# EAGLE design RM1xx-Breakout-min (EAGLE 7.7.0)
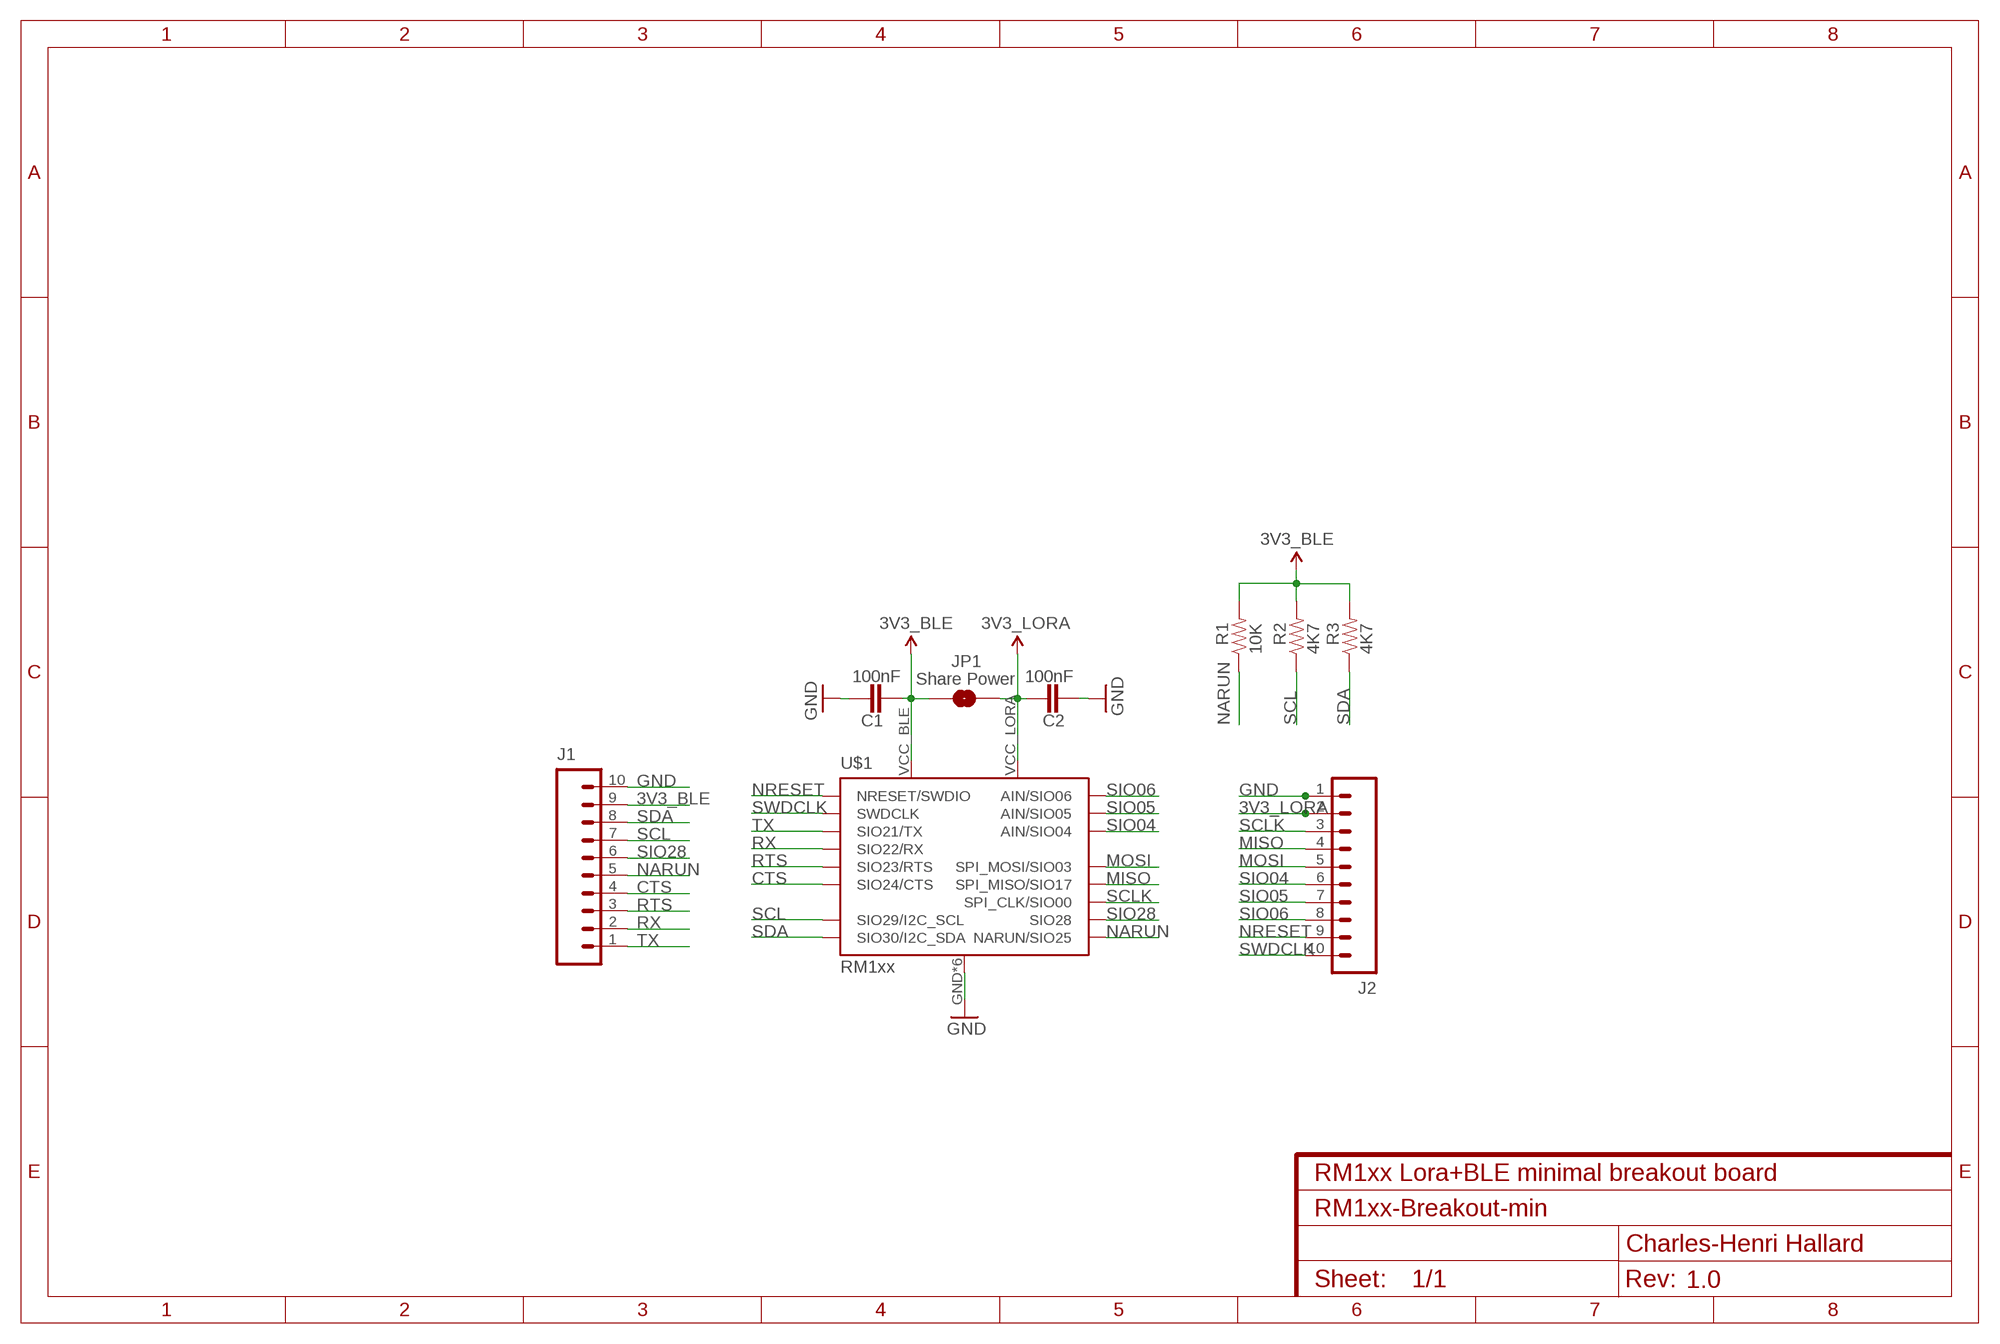
[diagram p0: schematic, sheet 1]
NAME (FRAME-A4L): CNAME: RM1xx Lora+BLE minimal breakout board; CREVISION: 1.0; DESIGNER: Charles-Henri Hallard

## Parts
C1  100nF  CAP0805-CAP  [0805-CAP]
C2  100nF  CAP0805-CAP  [0805-CAP]
J1  M10LOCK  [1X10_LOCK]
J2  M10LOCK  [1X10_LOCK]
JP1  Share Power  JUMPER-PAD-2-NOYES_SILK  [PAD-JUMPER-2-NO_YES_SILK]
R1  10K  RESISTOR0805-RES  [0805-RES]
R2  4K7  RESISTOR0805-RES  [0805-RES]
R3  4K7  RESISTOR0805-RES  [0805-RES]
U$1  RM1xx  RM1XXSMD  [RM1XX]

## Nets
3V3_BLE: C1.2 J1.9 JP1.1 R1.2 R2.2 R3.2 U$1.VCC_BLE
3V3_LORA: C2.1 J2.2 JP1.2 U$1.VCC_LORA
CTS: J1.4 U$1.SIO24(SIO24/CTS)
GND: C1.1 C2.2 J1.10 J2.1 U$1.GND U$1.GND1(GND) U$1.GND2(GND) U$1.GND3(GND) U$1.GND4(GND) U$1.GND5(GND)
MISO: J2.4 U$1.SIO17(SPI_MISO/SIO17)
MOSI: J2.5 U$1.SIO03(SPI_MOSI/SIO03)
NARUN: J1.5 R1.1 U$1.SIO25(NARUN/SIO25)
NRESET: J2.9 U$1.RESET(NRESET/SWDIO)
RTS: J1.3 U$1.SIO23(SIO23/RTS)
RX: J1.2 U$1.SIO22(SIO22/RX)
SCL: J1.7 R2.1 U$1.SIO29(SIO29/I2C_SCL)
SCLK: J2.3 U$1.SIO00(SPI_CLK/SIO00)
SDA: J1.8 R3.1 U$1.SIO30(SIO30/I2C_SDA)
SIO04: J2.6 U$1.SIO04(AIN/SIO04)
SIO05: J2.7 U$1.SIO05(AIN/SIO05)
SIO06: J2.8 U$1.SIO06(AIN/SIO06)
SIO28: J1.6 U$1.SIO28
SWDCLK: J2.10 U$1.SWDCLK
TX: J1.1 U$1.SIO21(SIO21/TX)

## Library data of the parts
C1 C2 = LowPowerLab:CAP: Capacitor Standard 0603 ceramic capacitor, and 0.1" leaded capacitor.
J1 J2 = SparkFun-Connectors:M10: Header 10 Standard 10-pin 0.1" header. Use with straight break away headers (SKU : PRT-00116), right angle break away headers (PRT-00553), swiss pins (PRT-00743), machine pins (PRT-00117), and female headers (PRT-00115).
JP1 = SparkFun-Passives:JUMPER-PAD-2-NO
R1-R3 = _c2h:RESISTOR: Resistor Basic schematic elements and footprints for 0603, 1206, and PTH resistors.
U$1 = _c2h:RM1XX

## Net classes
1 power: width 0.381 mm, clearance 0.254 mm

## Board
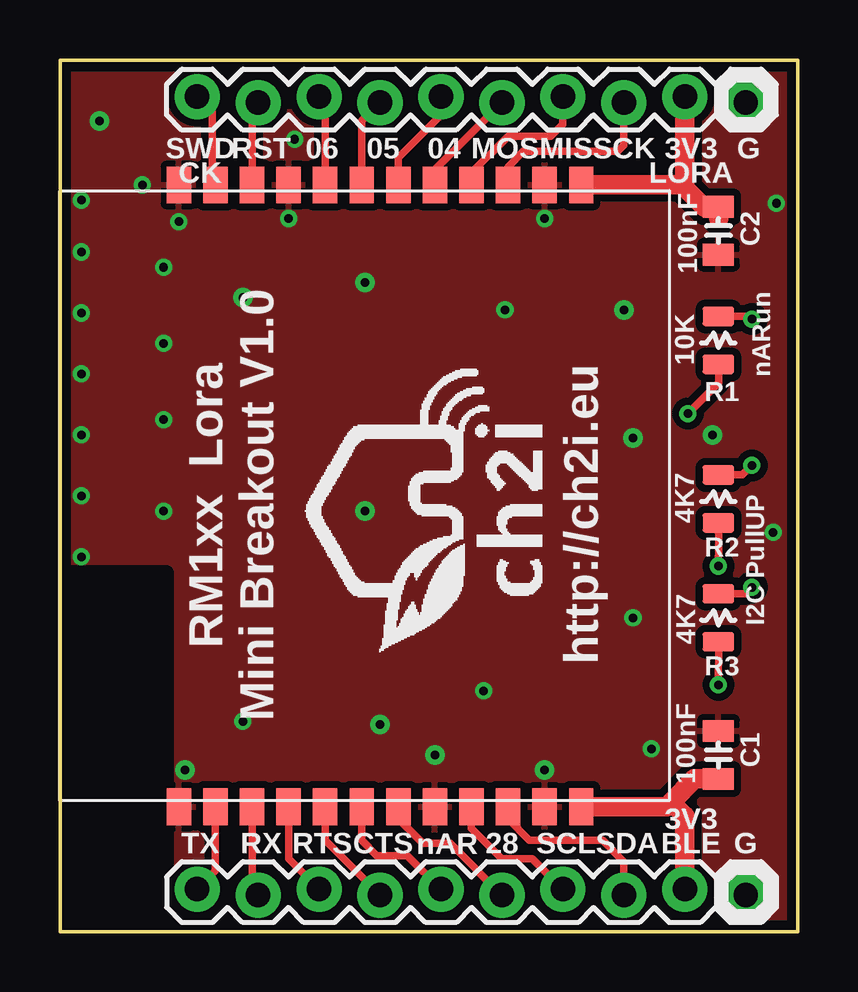
[diagram p1: board, top side]
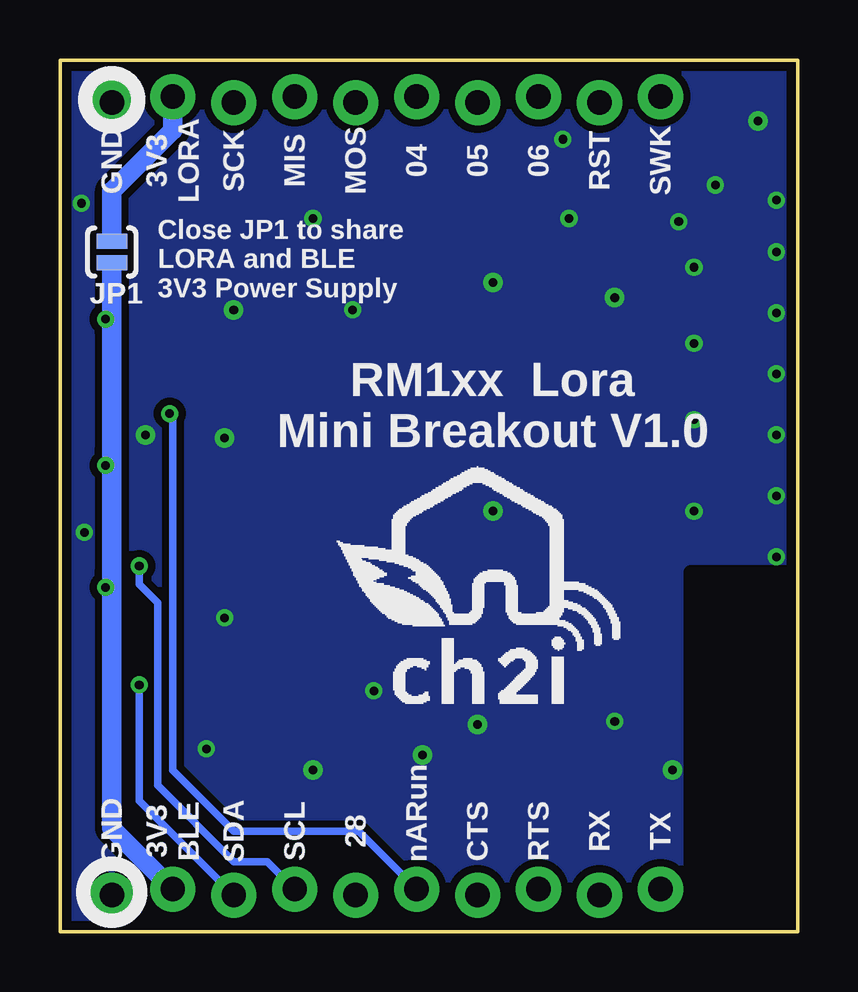
[diagram p2: board, bottom side, seen from below]

Size 30.73 x 36.32 mm. Coordinates in mm from the lower left corner, seen from the top.
Outline: 0,36.32 30.73,36.32 30.73,0 0,0 0,36.32
Copper layers (1*16): Top 0.0356mm / dielectric 1.5011mm / Bottom 0.0356mm
Design rules "PCBs_io": minimum track width 6mil, minimum drill 13mil, track to track 6mil, track to pad 6mil, pad to pad 6mil, via to via 6mil, smd to smd 6mil, copper to edge 15mil, drill to drill 6mil, minimum pad ring 7mil, minimum via ring 7mil, stop-mask expansion 3mil, vias tented up to drill 40mil, thermal gap 10mil
tRestrict: area 0,-0.3 to 4.4,15
bRestrict: area 0,-0.3 to 4.4,15

### Footprints (pad centres in the part's own frame; a part is rotated, then mirrored left to right if it is on the bottom)
0805-CAP = smd 0.902 x 1.3: 1 -1,0; 2 1,0
1X10_LOCK = drill 1.016 pad 1.88: 1 0,0.127; 2 2.54,-0.127; 3 5.08,0.127; 4 7.62,-0.127; 5 10.16,0.127; 6 12.7,-0.127; 7 15.24,0.127; 8 17.78,-0.127; 9 20.32,0.127; 10 22.86,-0.127
PAD-JUMPER-2-NO_YES_SILK = smd 0.635 x 1.27: 1 -0.45,0; 2 0.45,0
0805-RES = smd 0.8 x 1.3: 1 -1,0; 2 1,0
RM1XX = smd 1.524 x 1.016: GND -12.319,8.382; GND1 13.589,8.382; GND2 -12.319,-2.286; GND3 -12.319,-6.858; GND4 13.589,-6.858; GND5 13.589,3.81; RESET 13.589,5.334; SIO00 13.589,-5.334; SIO03 13.589,-2.286; SIO04 13.589,-0.762; SIO05 13.589,0.762; SIO06 13.589,2.286; SIO17 13.589,-3.81; SIO21 -12.319,6.858; SIO22 -12.319,5.334; SIO23 -12.319,3.81; SIO24 -12.319,2.286; SIO25 -12.319,0.762; SIO28 -12.319,-0.762; SIO29 -12.319,-3.81; SIO30 -12.319,-5.334; SWDCLK 13.589,6.858; VCC_BLE -12.319,-8.382; VCC_LORA 13.589,-8.382

### Placement (x,y rotation side)
C1  27.43,7.37 270 top
C2  27.43,29.21 270 top
J1  5.72,1.65 0 top
J2  28.57,34.67 180 top
JP1  28.57,28.32 90 bottom
R1  27.43,24.64 90 top
R2  27.43,18.03 90 top
R3  27.43,13.08 90 top
U$1  13.33,17.53 90 top
U$2  [LOGO_CH2I_110MM]  12.7,12.45 0 bottom
U$4  [LOGO_CH2I_110MM]  17.15,18.16 90 top

### Tracks (layer width: path | path; a pad name or v marks a point on that pad's centre or on a via)
3V3_BLE  (via drill 0.36 pad 0.71)
  Top 0.305: R3.2 28.56,14.08 v28.83,14.35 | R2.2 28.43,19.03 v28.83,19.43 | R1.2 28.72,25.64 v28.83,25.53
  Top 0.813: 27.45,6.35 C1.2 26.43,6.37 25.46,5.4 | 25.46,5.4 25.27,5.21 U$1.VCC_BLE | J1.9 26.03,4.83 25.46,5.4
  Bottom 0.305: v28.83,14.35 28.83,14.99 28.57,15.62 | v28.83,19.43 28.83,20.07 28.57,20.7 | v28.83,25.53 28.83,25.02 28.57,24.51
  Bottom 0.61: JP1.1 28.57,27.69
  Bottom 0.813: 28.57,27.69 28.57,24.51 28.57,20.7 28.57,15.62 28.57,4.32 J1.9
3V3_LORA
  Top 0.813: 21.73,31.1 U$1.VCC_LORA 25.91,31.11 | 25.91,31.11 26.81,30.21 C2.1 27.45,29.72 | J2.2 26.03,31.24 25.91,31.11
  Bottom 0.61: JP1.2 28.57,29.08
  Bottom 0.813: 28.57,29.08 28.57,30.86 26.03,33.4 J2.2
CTS
  Top 0.305: U$1.SIO24 11.05,3.81 J1.4
GND  (via drill 0.36 pad 0.71, 0.36 pad 0.81)
  Top 0.305: U$1.GND 4.7,5.21
  other vias: 1.65,33.78 27.18,20.7 7.62,26.42 29.72,16.64 7.62,8.76 18.54,25.91 17.65,10.03 0.89,15.62 0.89,18.16 0.89,20.7 0.89,23.24 0.89,25.78 0.89,28.32 0.89,30.48 29.84,30.35 23.88,13.08 23.49,25.91 23.88,20.57 12.7,17.53 12.7,27.05 13.33,8.64 15.62,7.37 20.19,6.73 5.21,6.73 20.19,29.72 9.53,29.72 4.95,29.59 3.43,31.11 4.32,27.69 4.32,24.51 4.32,21.34 4.32,17.53 9.78,33.02 24.64,7.62
  pour Top (isolate 0.305, rank 6): -1.27,37.47 -1.27,-1.14 31.11,-1.14 31.11,37.47
  pour Bottom (isolate 0.305): -1.9,38.1 -1.9,-1.78 31.75,-1.78 31.75,38.1
MISO
  Top 0.305: U$1.SIO17 17.15,31.62 18.67,33.15 20.45,33.15 20.95,33.66 J2.4
MOSI
  Top 0.305: U$1.SIO03 15.62,31.75 J2.5
NARUN  (via drill 0.36 pad 0.71)
  Top 0.305: R1.1 27.45,22.88 v26.16,21.59 | U$1.SIO25 12.57,3.81 13.21,3.18 14.48,3.18 J1.5
  Bottom 0.305: J1.5 18.29,4.19 23.49,4.19 26.03,6.73 26.03,21.46 v26.16,21.59
NRESET
  Top 0.305: U$1.RESET 8,34.29 J2.9
RTS
  Top 0.305: U$1.SIO23 9.53,3.05 J1.3
RX
  Top 0.305: U$1.SIO22 8,1.78 J1.2
SCL  (via drill 0.36 pad 0.71)
  Top 0.305: R2.1 27.45,16.14 v27.43,15.24 | U$1.SIO29 17.15,4.32 18.41,3.05 19.69,3.05 J1.7
  Bottom 0.305: v27.43,15.24 27.43,14.48 26.67,13.72 26.67,6.1 23.49,2.92 22.1,2.92 J1.7
SCLK
  Top 0.305: U$1.SIO00 18.67,31.88 19.3,32.51 23.24,32.51 23.49,32.77 J2.3
SDA  (via drill 0.36 pad 0.71)
  Top 0.305: R3.1 27.45,11.95 v27.43,10.29 | U$1.SIO30 18.67,4.7 19.56,3.81 22.61,3.81 23.49,2.92 J1.8
  Bottom 0.305: 23.62,1.52 J1.8 27.43,5.46 v27.43,10.29
SIO04
  Top 0.305: U$1.SIO04 14.1,32.26 15.88,34.04 J2.6
SIO05
  Top 0.305: U$1.SIO05 12.57,33.78 J2.7
SIO06
  Top 0.305: U$1.SIO06 11.05,34.54 J2.8
SIO28
  Top 0.305: U$1.SIO28 14.1,4.7 15.11,3.68 16.26,3.68 J1.6
SWDCLK
  Top 0.305: U$1.SWDCLK 6.35,31.11 6.35,34.16 J2.10
TX
  Top 0.305: U$1.SIO21 6.48,2.54 J1.1

### Text on the board
tPlace: SWD | RST | 06 | 05 | 04 | MOS | MIS | SCK | 3V3 | G | CK | LORA | nARun | RM1xx Lora / Mini Breakout V1.0 | http://ch2i.eu | I2C PullUP | 3V3 | TX | RX | RTS | CTS | nAR | 28 | SCL | SDA | BLE | G
bPlace: SWK | RST | 06 | 05 | 04 | MOS | MIS | SCK | 3V3 / LORA | GND | Close JP1 to share / LORA and BLE / 3V3 Power Supply | RM1xx Lora / Mini Breakout V1.0 | TX | RX | RTS | CTS | nARun | 28 | SCL | SDA | 3V3 / BLE | GND